# EAGLE schematic PIPduino (EAGLE 6.4)
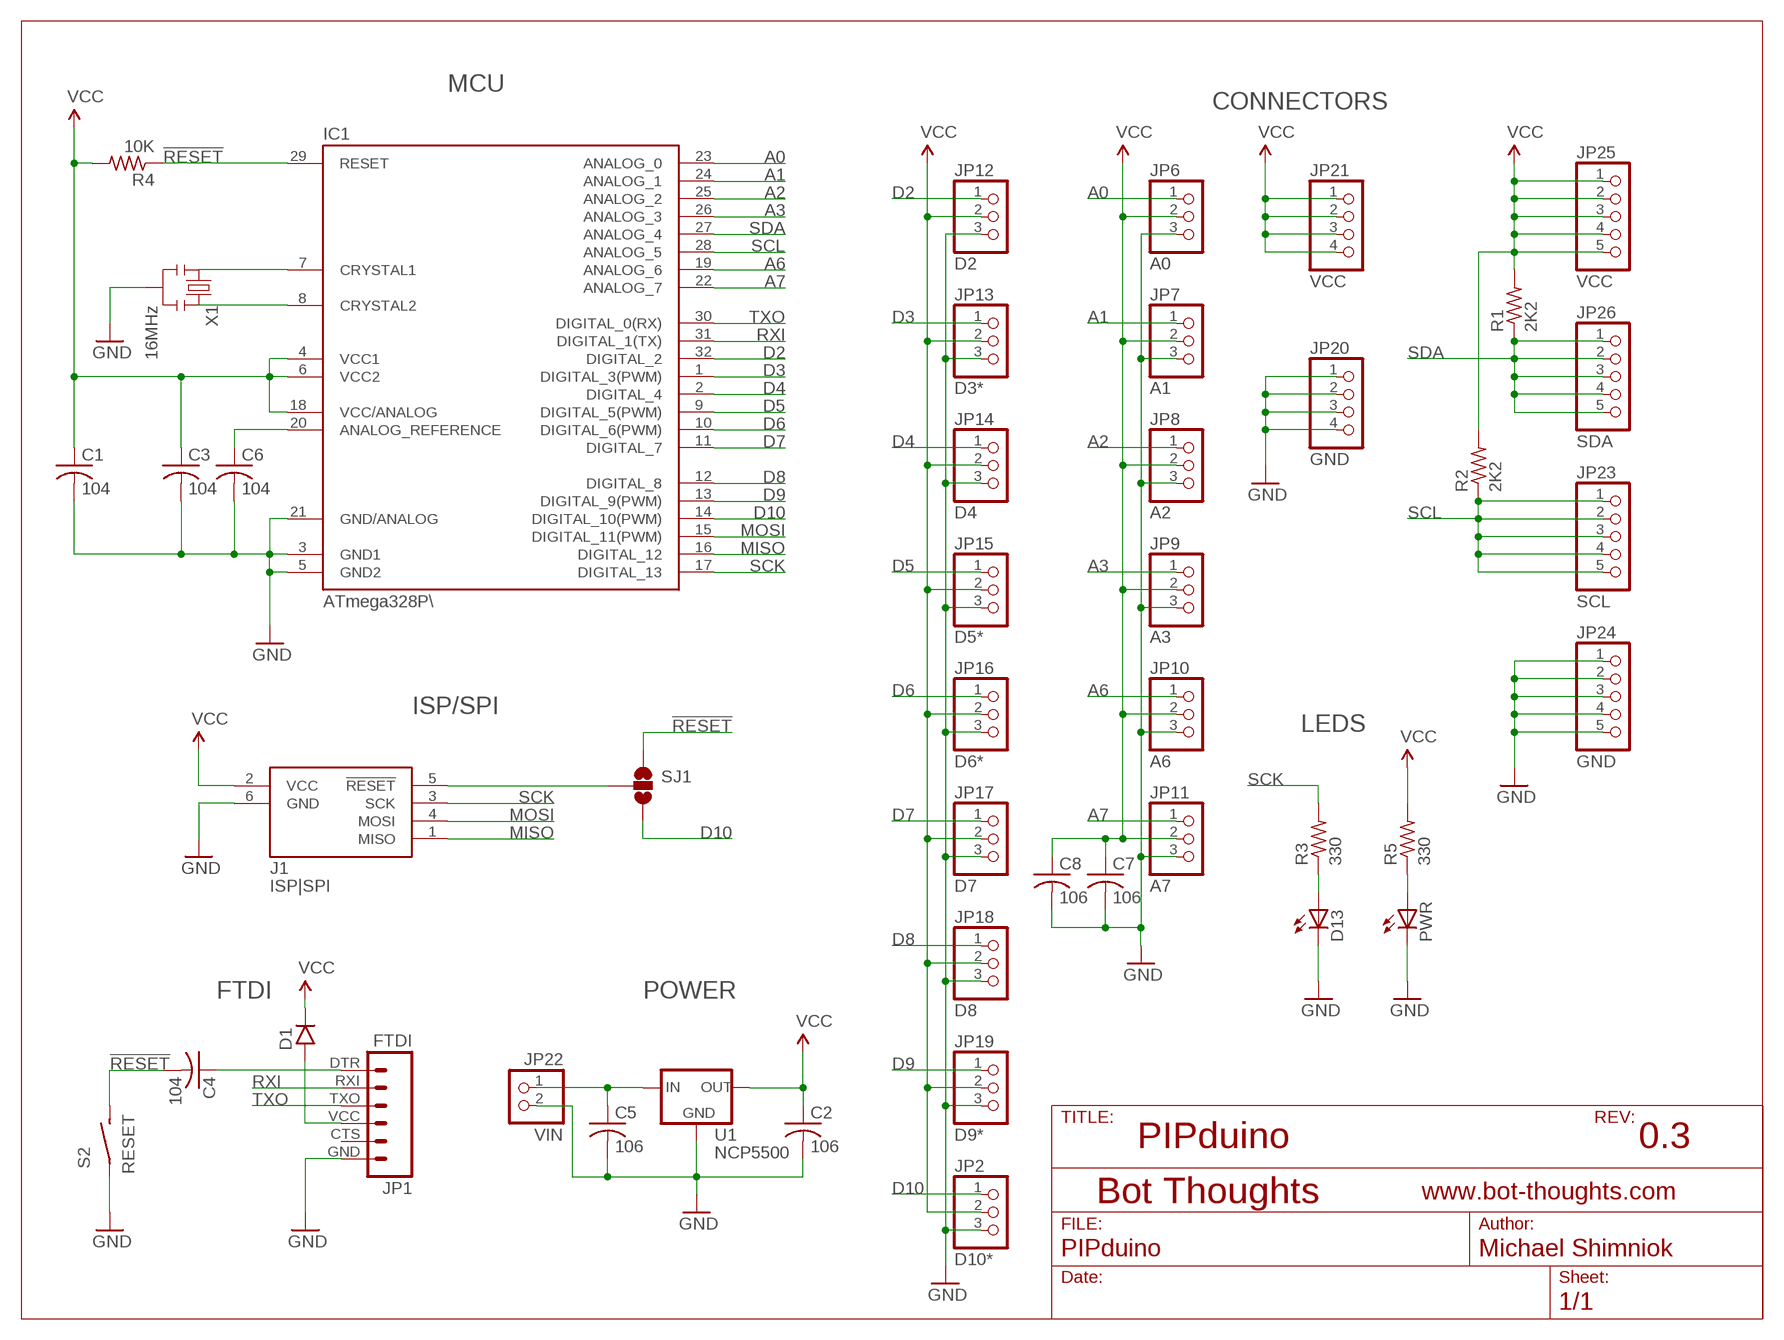
[diagram p0: schematic, sheet 1]

## Parts
C1  104  C-USC0603  [C0603]
C2  106  C-USC1206  [C1206]
C3  104  C-USC0603  [C0603]
C4  104  C-USC0603  [C0603]
C5  106  C-USC1206  [C1206]
C6  104  C-USC0603  [C0603]
C7  106  C-USC1206  [C1206]
C8  106  C-USC1206  [C1206]
D1  DIODE_SOD123FL  [SOD123FL]
D13  LED3MM  [LED3MM]
IC1  ATmega328P\  ATMEGA168-AU  [TQFP32-08]
J1  ISP|SPI  AVRISP6_COMPACT  [CON6P2R]
JP1  FTDI  FTDI_BASICPTH  [FTDI_BASIC]
JP2  D10*  PINHD-1X03_2.54-S  [1X03-S]
JP6  A0  PINHD-1X03_2.54-S  [1X03-S]
JP7  A1  PINHD-1X03_2.54-S  [1X03-S]
JP8  A2  PINHD-1X03_2.54-S  [1X03-S]
JP9  A3  PINHD-1X03_2.54-S  [1X03-S]
JP10  A6  PINHD-1X03_2.54-S  [1X03-S]
JP11  A7  PINHD-1X03_2.54-S  [1X03-S]
JP12  D2  PINHD-1X03_2.54-S  [1X03-S]
JP13  D3*  PINHD-1X03_2.54-S  [1X03-S]
JP14  D4  PINHD-1X03_2.54-S  [1X03-S]
JP15  D5*  PINHD-1X03_2.54-S  [1X03-S]
JP16  D6*  PINHD-1X03_2.54-S  [1X03-S]
JP17  D7  PINHD-1X03_2.54-S  [1X03-S]
JP18  D8  PINHD-1X03_2.54-S  [1X03-S]
JP19  D9*  PINHD-1X03_2.54-S  [1X03-S]
JP20  GND  PINHD-1X04_2.54-S  [1X04-S]
JP21  VCC  PINHD-1X04_2.54-S  [1X04-S]
JP22  VIN  PINHD-1X02_2.54-S  [1X02-S]
JP23  SCL  PINHD-1X05_2.54-S  [1X05-S]
JP24  GND  PINHD-1X05_2.54-S  [1X05-S]
JP25  VCC  PINHD-1X05_2.54-S  [1X05-S]
JP26  SDA  PINHD-1X05_2.54-S  [1X05-S]
PWR  LED3MM  [LED3MM]
R1  2K2  R-US_R0603  [R0603]
R2  2K2  R-US_R0603  [R0603]
R3  330  R-US_R0603  [R0603]
R4  10K  R-US_R0603  [R0603]
R5  330  R-US_R0603  [R0603]
S2  RESET  SPST_3X4X2  [3X4X2TACT]
SJ1  SOLDERJUMPER_2WAYS  [SJ_3]
U1  NCP5500  [DPAK]
X1  16MHz  RESONATOR_CSTCE_V_C  [CSTCE_V_C]

## Nets
!RESET: C4.2 IC1.29(RESET) R4.1 S2.P$2(S) SJ1.1
A0: IC1.23(ANALOG_0) JP6.1
A1: IC1.24(ANALOG_1) JP7.1
A2: IC1.25(ANALOG_2) JP8.1
A3: IC1.26(ANALOG_3) JP9.1
A6: IC1.19(ANALOG_6) JP10.1
A7: IC1.22(ANALOG_7) JP11.1
D2: IC1.32(DIGITAL_2) JP12.1
D3: IC1.1(DIGITAL_3(PWM)) JP13.1
D4: IC1.2(DIGITAL_4) JP14.1
D5: IC1.9(DIGITAL_5(PWM)) JP15.1
D6: IC1.10(DIGITAL_6(PWM)) JP16.1
D7: IC1.11(DIGITAL_7) JP17.1
D8: IC1.12(DIGITAL_8) JP18.1
D9: IC1.13(DIGITAL_9(PWM)) JP19.1
D10: IC1.14(DIGITAL_10(PWM)) JP2.1 SJ1.3
GND: C1.2 C2.2 C3.2 C5.2 C6.2 C7.2 C8.2 D13.K(C) IC1.3(GND1) IC1.5(GND2) IC1.21(GND/ANALOG) J1.6(GND) JP1.GND JP2.3 JP6.3 JP7.3 JP8.3 JP9.3 JP10.3 JP11.3 JP12.3 JP13.3 JP14.3 JP15.3 JP16.3 JP17.3 JP18.3 JP19.3 JP20.1 JP20.2 JP20.3 JP20.4 JP22.2 JP24.1 JP24.2 JP24.3 JP24.4 JP24.5 PWR.K(C) S2.P$1(P) U1.4(GND) X1.GND
MISO: IC1.16(DIGITAL_12) J1.1(MISO)
MOSI: IC1.15(DIGITAL_11(PWM)) J1.4(MOSI)
N$1: D13.A R3.1
N$2: C5.1 JP22.1 U1.1(VIN)
N$3: J1.5(!RESET) SJ1.2
N$4: PWR.A R5.1
N$5: D1.A JP1.VCC
N$6: C6.1 IC1.20(ANALOG_REFERENCE)
N$8: IC1.7(CRYSTAL1) X1.X1
N$13: IC1.8(CRYSTAL2) X1.X2
N$15: C4.1 JP1.DTR
RXI: IC1.31(DIGITAL_1(TX)) JP1.RXI
SCK: IC1.17(DIGITAL_13) J1.3(SCK) R3.2
SCL: IC1.28(ANALOG_5) JP23.1 JP23.2 JP23.3 JP23.4 JP23.5 R2.1
SDA: IC1.27(ANALOG_4) JP26.1 JP26.2 JP26.3 JP26.4 JP26.5 R1.1
TXO: IC1.30(DIGITAL_0(RX)) JP1.TXO
VCC: C1.1 C2.1 C3.1 C7.1 C8.1 D1.C IC1.4(VCC1) IC1.6(VCC2) IC1.18(VCC/ANALOG) J1.2(VCC) JP2.2 JP6.2 JP7.2 JP8.2 JP9.2 JP10.2 JP11.2 JP12.2 JP13.2 JP14.2 JP15.2 JP16.2 JP17.2 JP18.2 JP19.2 JP21.1 JP21.2 JP21.3 JP21.4 JP25.1 JP25.2 JP25.3 JP25.4 JP25.5 R1.2 R2.2 R4.2 R5.2 U1.3(VOUT)
Unconnected: JP1.CTS

## Notes on the sheet
- MCU
- CONNECTORS
- ISP/SPI
- LEDS
- FTDI | POWER
- PIPduino | 0.3

## Library data of the parts
C1-C8 = rcl:C-US: CAPACITOR, American symbol
D1 = bt_diode:DIODE: Diode Collection of generic diodes in various packages
D13 PWR = bt_opto:LED: LED Various packages
IC1 = Arduino-AVR:ATMEGA168
J1 = bt_avr:AVRISP6: 6-pin dual-row connector for Atmel AVRISP programmer interface
JP1 = SparkFun:FTDI_BASIC: FTDI Basic: 3.3V and 5V
JP2 JP6-JP19 = pinhead-2:PINHD-1X03: PIN HEADER
JP20 JP21 = pinhead-2:PINHD-1X04: PIN HEADER
JP22 = pinhead-2:PINHD-1X02: PIN HEADER
JP23-JP26 = pinhead-2:PINHD-1X05: PIN HEADER
R1-R5 = rcl:R-US_: RESISTOR, American symbol
S2 = bt_electromech:SPST: SPST SWITCH
SJ1 = SparkFun-Passives:SOLDERJUMPER_2WAY: Solder Jumper 2 way solder jumper
U1 = bt_regulator:NCP5500: NCP5500, NCV5500, NCP5501, NCV5501 LDO Voltage Regulator These linear low drop voltage regulators provide up to 500 mA over a user−adjustable output range of 1.25 V to 5.0 V, or at a fixed output voltage of 1.5 V, 3.3 V or 5.0 V, with typical output voltage accuracy better than 3%. Reverse bias protection, thermal shutdown, and short circuit protection. Dropout is 230 mV at 500 mA
X1 = bt_crystal:RESONATOR: Crystal Resonator, 3-pin

## Net classes
1 power: width 0.254 mm